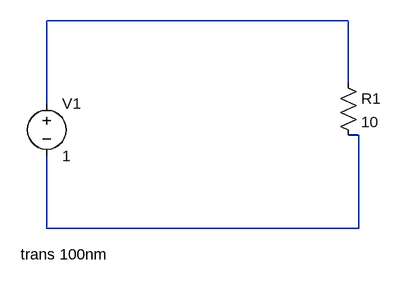
[diagram p0: schematic Draft3.asc]
Draft3.asc, the LTspice schematic file:
Version 4
SHEET 1 880 680
WIRE 496 192 32 192
WIRE 496 288 496 192
WIRE 32 320 32 192
WIRE 512 368 496 368
WIRE 32 512 32 400
WIRE 512 512 512 368
WIRE 512 512 32 512
SYMBOL res 480 272 R0
SYMATTR InstName R1
SYMATTR Value 10
SYMBOL voltage 32 304 R0
SYMATTR InstName V1
SYMATTR Value 1
TEXT -8 552 Left 2 !trans 100nm

The netlist it stands for:
* Draft3.asc
R1 N001 N002 10
V1 N001 N002 1
trans 100nm
.backanno
.end